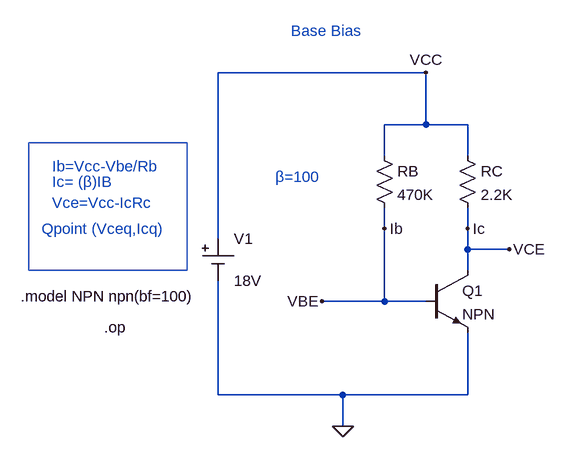
[diagram p0: schematic base_bias_ckt.asc]
base_bias_ckt.asc, the LTspice schematic file:
Version 4
SHEET 1 880 680
WIRE 416 0 96 0
WIRE 416 80 416 0
WIRE 416 80 352 80
WIRE 480 80 416 80
WIRE 352 128 352 80
WIRE 480 128 480 80
WIRE 352 240 352 208
WIRE 480 240 480 208
WIRE 96 256 96 0
WIRE 480 272 480 240
WIRE 544 272 480 272
WIRE 480 304 480 272
WIRE 352 352 352 240
WIRE 352 352 256 352
WIRE 416 352 352 352
WIRE 96 496 96 320
WIRE 288 496 96 496
WIRE 480 496 480 400
WIRE 480 496 288 496
WIRE 288 544 288 496
FLAG 288 544 0
FLAG 416 0 VCC
FLAG 544 272 VCE
FLAG 256 352 VBE
FLAG 352 240 Ib
FLAG 480 240 Ic
SYMBOL npn 416 304 R0
SYMATTR InstName Q1
SYMBOL res 336 112 R0
SYMATTR InstName RB
SYMATTR Value 470K
SYMBOL res 464 112 R0
SYMATTR InstName RC
SYMATTR Value 2.2K
SYMBOL Misc/cell 96 256 R0
SYMATTR InstName V1
SYMATTR Value 18V
TEXT 208 -64 Left 2 ;Base Bias
TEXT -160 144 Left 2 ;Ib=Vcc-Vbe/Rb
TEXT -160 168 Left 2 ;Ic= (β)IB
TEXT -160 200 Left 2 ;Vce=Vcc-IcRc
TEXT -176 240 Left 2 ;Qpoint (Vceq,Icq)
TEXT 184 160 Left 2 ;β=100
TEXT -208 344 Left 2 !.model NPN npn(bf=100)
TEXT -80 392 Left 2 !.op
RECTANGLE Normal 48 304 -196 108

The netlist it stands for:
* base_bias_ckt.asc
Q1 Ic Ib 0 0 NPN
RB VCC Ib 470K
RC VCC Ic 2.2K
V1 VCC 0 18V
.model NPN NPN
.model PNP PNP
.lib standard.bjt
* Base Bias
* Ib=Vcc-Vbe/Rb
* Ic= (β)IB
* Vce=Vcc-IcRc
* Qpoint (Vceq,Icq)
* β=100
.model NPN npn(bf=100)
.op
.backanno
.end